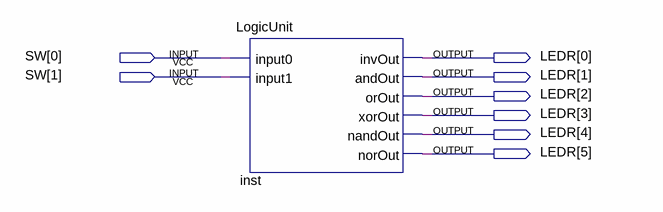
[diagram p0: schematic sheet]
// Quartus schematic LogicTop.bdf as structural Verilog: 1 symbols, 8 pins
module LogicTop (
  input  [1:0] SW,
  output [5:0] LEDR
);

  LogicUnit inst (
    .input0(SW[0]), .input1(SW[1]), .invOut(LEDR[0]), .andOut(LEDR[1]), .orOut(LEDR[2]), .xorOut(LEDR[3]),
    .nandOut(LEDR[4]), .norOut(LEDR[5]));
endmodule
